# EAGLE design OCTOBOARDV_1.2 (EAGLE 9.6.0)
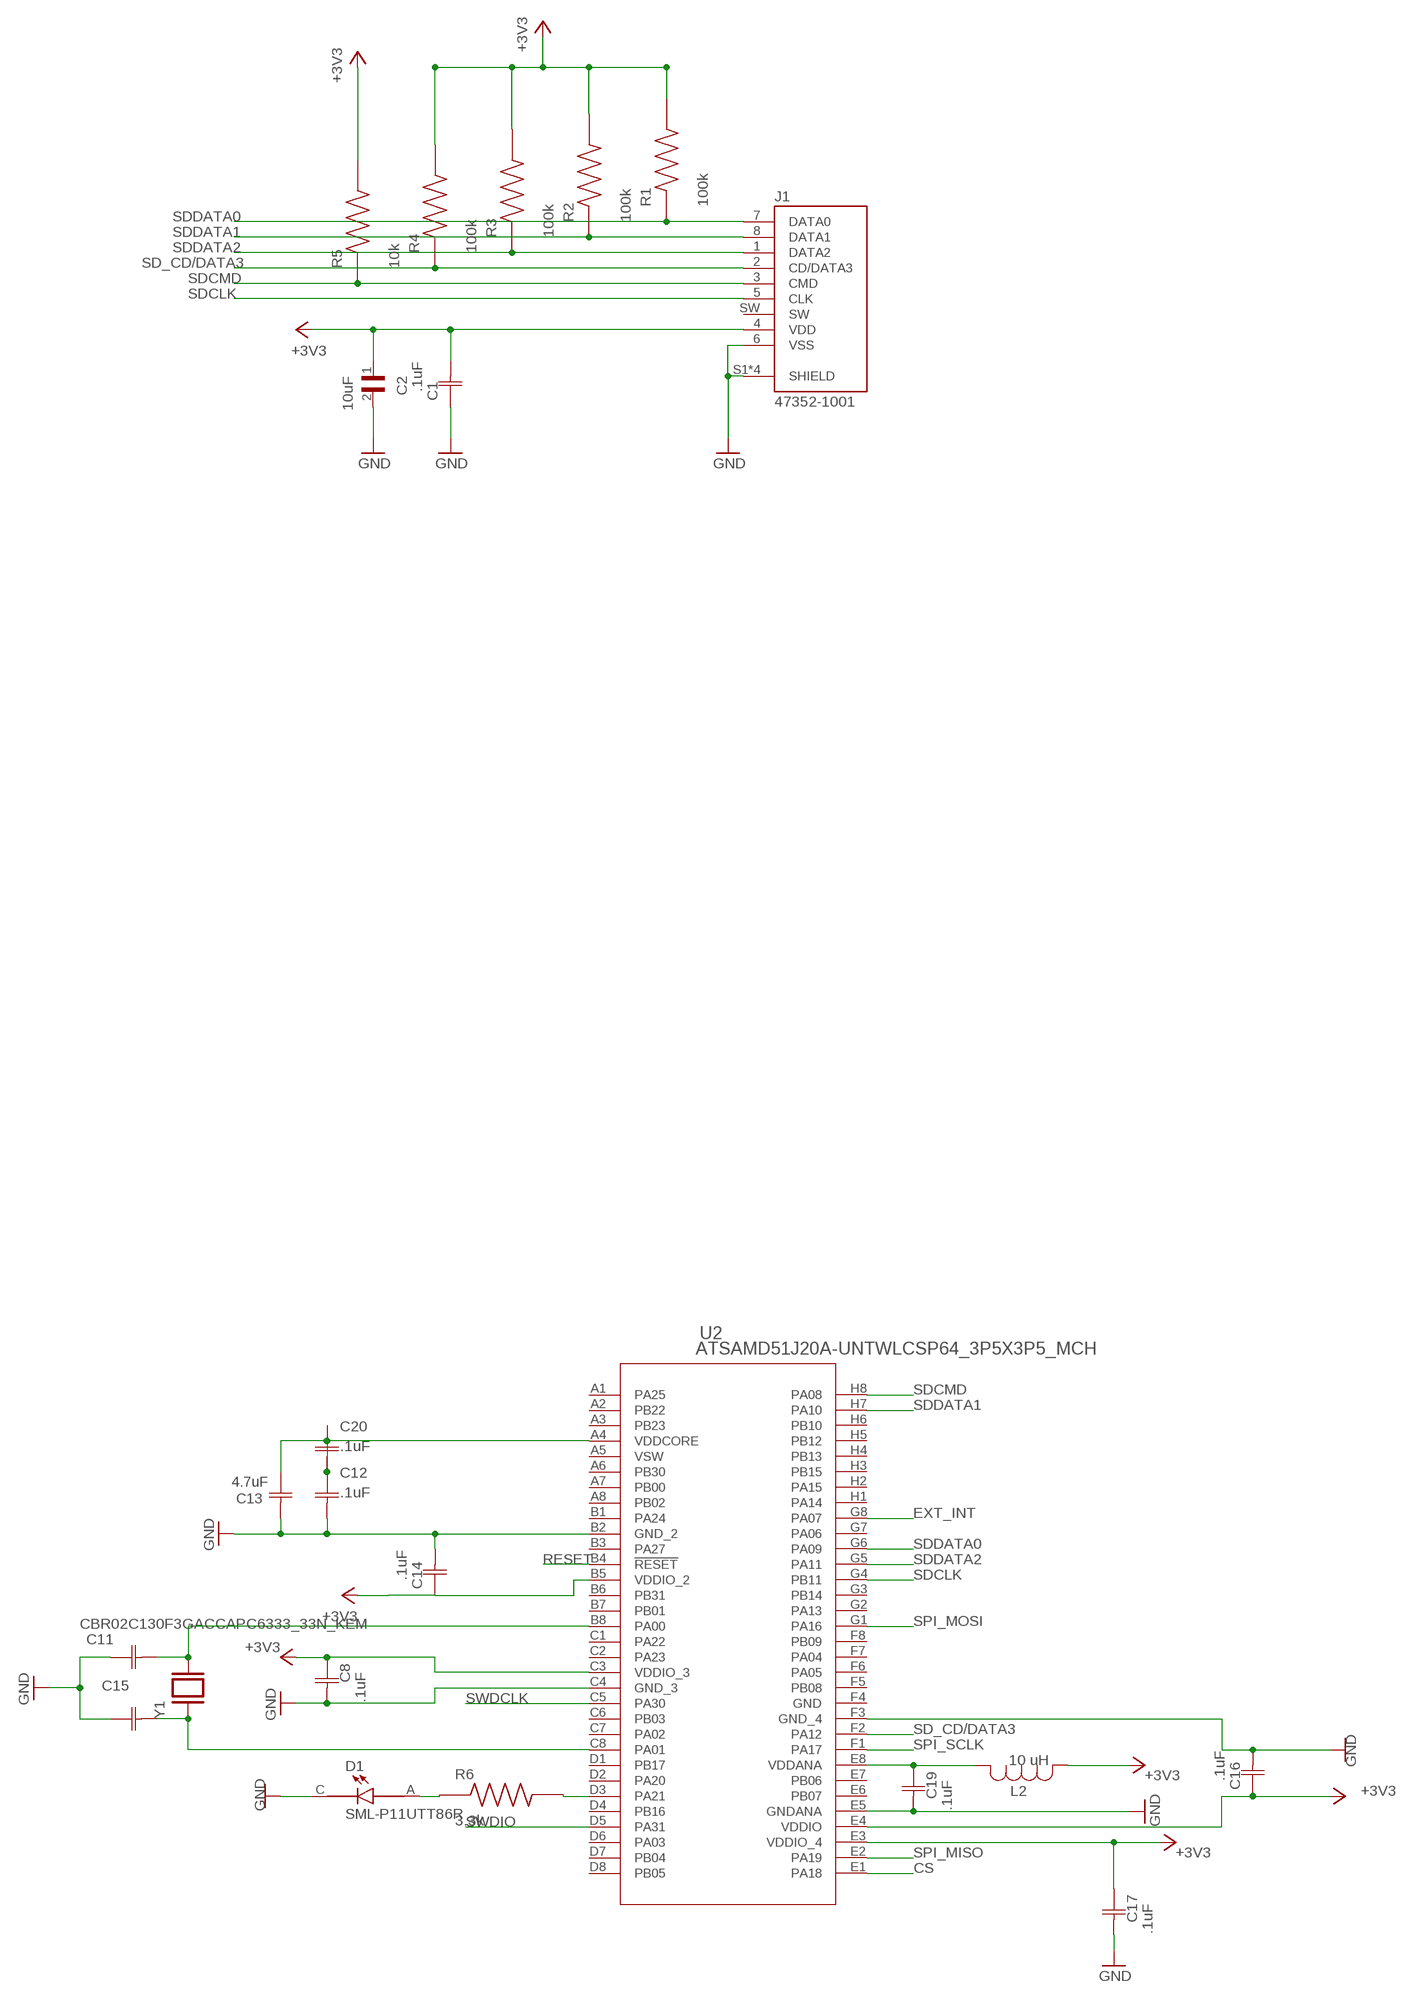
[diagram p0: schematic, sheet 1, part 1 of 2]
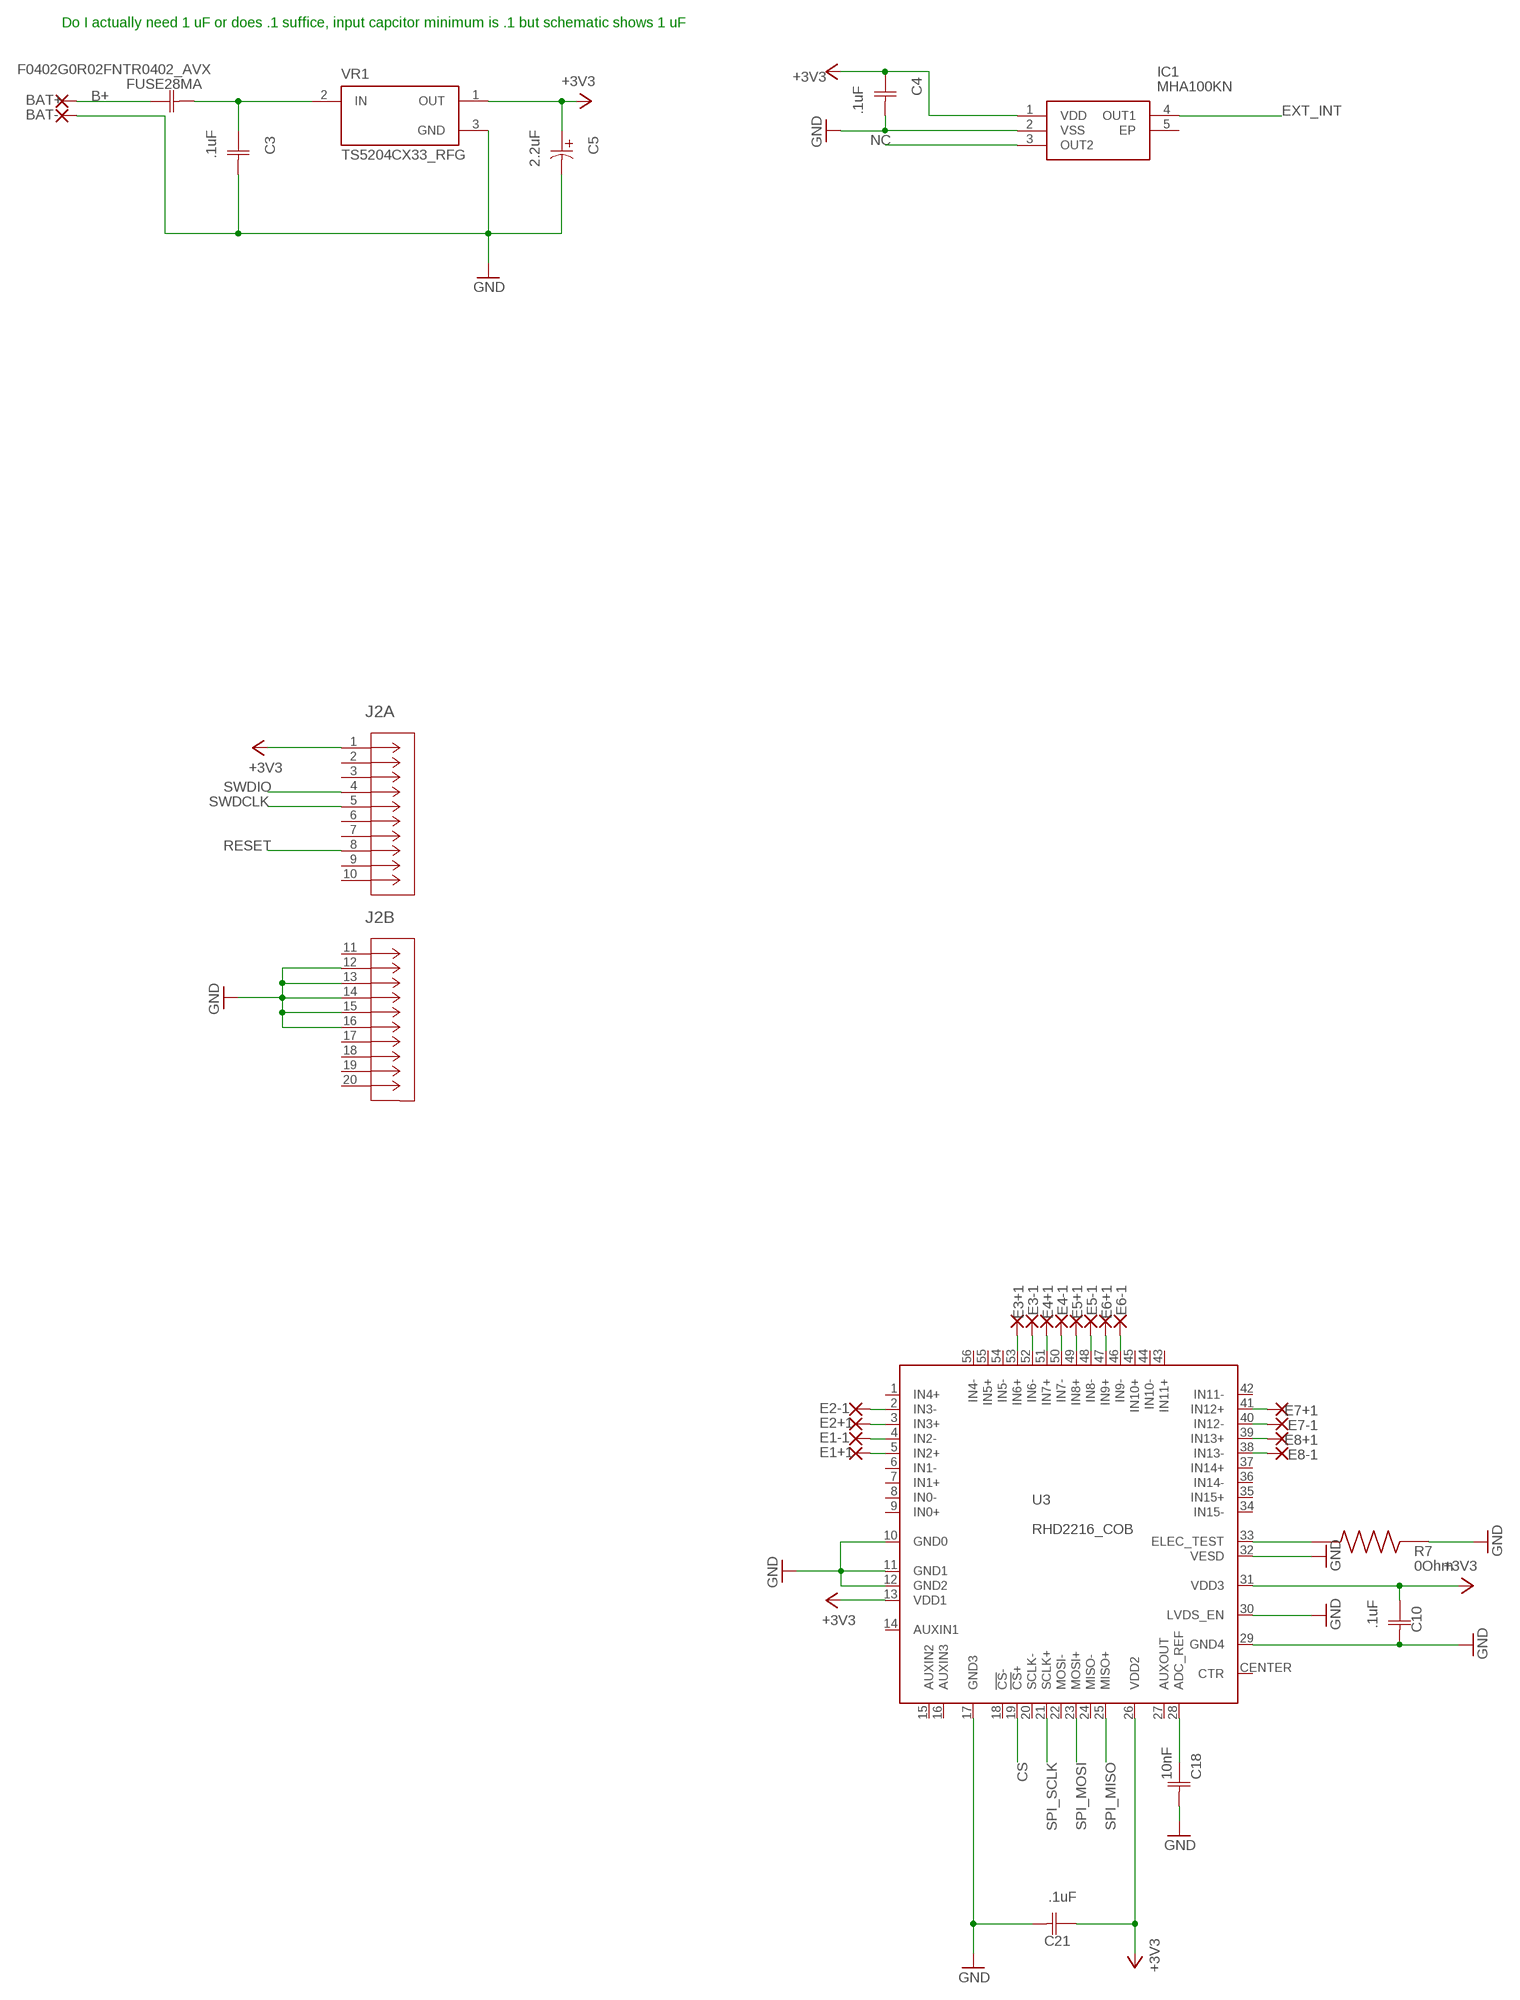
[diagram p1: schematic, sheet 1, part 2 of 2]

## Parts
BAT+  1.36/.71LEAD  [1,6/0,9]
BAT-  1.36/.71LEAD  [1,6/0,9]
C1  .1uF  0402B104K250CTCAP_0402_WAL  [CAP_0402_WAL]
C2  10uF  GRM155R61A106ME11D  [CAPC1005X70N]
C3  .1uF  0402B104K250CTCAP_0402_WAL  [CAP_0402_WAL]
C4  .1uF  0402B104K250CTCAP_0402_WAL  [CAP_0402_WAL]
C5  2.2uF  T491A225K016ATAUTOCAPMP3.4X1.6_1.8N_KEM  [CAPMP3.4X1.6_1.8N_KEM]
C8  .1uF  0402B104K250CTCAP_0402_WAL  [CAP_0402_WAL]
C10  .1uF  0402B104K250CTCAP_0402_WAL  [CAP_0402_WAL]
C11  CBR02C130F3GACCAPC6333_33N_KEM  [CAPC6333_33N_KEM]
C12  .1uF  0402B104K250CTCAP_0402_WAL  [CAP_0402_WAL]
C13  4.7uF  CM03X5R475M06AH055CAP_CM03_F_KAV  [CAP_CM03_F_KAV]
C14  .1uF  0402B104K250CTCAP_0402_WAL  [CAP_0402_WAL]
C15  CBR02C130F3GACCAPC6333_33N_KEM  [CAPC6333_33N_KEM]
C16  .1uF  0402B104K250CTCAP_0402_WAL  [CAP_0402_WAL]
C17  .1uF  0402B104K250CTCAP_0402_WAL  [CAP_0402_WAL]
C18  10nF  CM02X5R103M16AHCAP_00J25AH_AVX  [CAP_00J25AH_AVX]
C19  .1uF  0402B104K250CTCAP_0402_WAL  [CAP_0402_WAL]
C20  .1uF  0402B104K250CTCAP_0402_WAL  [CAP_0402_WAL]
C21  .1uF  0402B104K250CTCAP_0402_WAL  [CAP_0402_WAL]
D1  SML-P11UTT86R  [LED_SML-P11UTT86R]
E1+1  1.36/.71LEAD  [1,6/0,9]
E1-1  1.36/.71LEAD  [1,6/0,9]
E2+1  1.36/.71LEAD  [1,6/0,9]
E2-1  1.36/.71LEAD  [1,6/0,9]
E3+1  1.36/.71LEAD  [1,6/0,9]
E3-1  1.36/.71LEAD  [1,6/0,9]
E4+1  1.36/.71LEAD  [1,6/0,9]
E4-1  1.36/.71LEAD  [1,6/0,9]
E5+1  1.36/.71LEAD  [1,6/0,9]
E5-1  1.36/.71LEAD  [1,6/0,9]
E6+1  1.36/.71LEAD  [1,6/0,9]
E6-1  1.36/.71LEAD  [1,6/0,9]
E7+1  1.36/.71LEAD  [1,6/0,9]
E7-1  1.36/.71LEAD  [1,6/0,9]
E8+1  1.36/.71LEAD  [1,6/0,9]
E8-1  1.36/.71LEAD  [1,6/0,9]
FUSE28MA  F0402G0R02FNTR0402_AVX  F0402G0R20FNTR0402_AVX  [0402_AVX]
IC1  MHA100KN  [MHA100KN]
J1  47352-1001  [MOLEX_47352-1001]
J2  PRPC040DAAN-RCCONN80_PRP-040_4000X197_SUL  [CONN80_PRP-040_4000X197_SUL]
L2  10 uH  SDEB12101T-100MSDIND_SDEB12101T_CYN  [IND_SDEB12101T_CYN]
R1  100k  ERJ1GNJ104C  [RES_ERJ1GNJ104C]
R2  100k  ERJ1GNJ104C  [RES_ERJ1GNJ104C]
R3  100k  ERJ1GNJ104C  [RES_ERJ1GNJ104C]
R4  100k  ERJ1GNJ104C  [RES_ERJ1GNJ104C]
R5  10k  ERJ-1RHD1002C  [RES_ERJ-1RHD1002C]
R6  3.3k  ERJ-1GNF3301C  [RESC0603X26N]
R7  0Ohm  RMCF0201ZT0R00  [RESC0603X26N]
U2  ATSAMD51J20A-UNTWLCSP64_3P5X3P5_MCH  [WLCSP64_3P5X3P5_MCH]
U3  RHD2216_COB  [RHD2000_56PIN_COB]
VR1  TS5204CX33_RFG  [SOT95P280X110-3N]
Y1  CM9V-T1A-32.768KHZ-9PF-20PPM-TA-QC  [XTAL_CM9V-T1A-32.768KHZ-9PF-20PPM-TA-QC]

## Nets
+3V3: C1.2 C2.1 C4.1 C5.1 C8.1 C10.1 C17.1 C21.1 IC1.1(VDD) J1.4(VDD) J2.1 L2.2 R1.2 R2.2 R3.2 R4.2 R5.2 U2.C3(VDDIO_3) U2.E3(VDDIO_4) U3.13(VDD1) U3.26(VDD2) U3.31(VDD3) VR1.1(OUT)
B+: BAT+.1(P) FUSE28MA.1
CS: U2.E1(PA18) U3.19(!CS!+)
EXT_INT: IC1.4(OUT1) U2.G8(PA07)
GND: BAT-.1(P) C1.1 C2.2 C3.2 C4.2 C5.2 C8.2 C10.2 C11.1 C12.2 C13.2 C14.2 C15.1 C17.2 C18.2 C19.2 C21.2 D1.C IC1.2(VSS) J1.6(VSS) J1.S1(SHIELD) J1.S2(SHIELD) J1.S3(SHIELD) J1.S4(SHIELD) J2.12 J2.13 J2.14 J2.15 J2.16 R7.2 U2.B2(GND_2) U2.C4(GND_3) U2.E5(GNDANA) U3.10(GND0) U3.11(GND1) U3.12(GND2) U3.17(GND3) U3.29(GND4) U3.30(LVDS_EN) U3.32(VESD) VR1.3(GND)
N$1: C3.1 FUSE28MA.2 VR1.2(IN)
N$6: C18.1 U3.28(ADC_REF)
N$18: D1.A R6.1
N$21 [Test]: C11.2 U2.B8(PA00) Y1.2
N$24: R6.2 U2.D3(PA21)
N$25 [Test]: C15.2 U2.C8(PA01) Y1.1
N$31: R7.1 U3.33(ELEC_TEST)
N$33: E1+1.1(P) U3.5(IN2+)
N$34: E1-1.1(P) U3.4(IN2-)
N$35: E2+1.1(P) U3.3(IN3+)
N$36: E2-1.1(P) U3.2(IN3-)
N$37: E3+1.1(P) U3.53(IN6+)
N$38: E3-1.1(P) U3.52(IN6-)
N$39: E4+1.1(P) U3.51(IN7+)
N$40: E4-1.1(P) U3.50(IN7-)
N$41: E5+1.1(P) U3.49(IN8+)
N$42: C19.1 L2.1 U2.E8(VDDANA)
N$43: C16.2 U2.F3(GND_4) ; supply symbol labelled GND
N$44: C16.1 U2.E4(VDDIO) ; supply symbol labelled +3V3
N$45: C12.1 C13.1 C20.2 U2.A4(VDDCORE)
N$46: E5-1.1(P) U3.48(IN8-)
N$47: E6+1.1(P) U3.47(IN9+)
N$48: C14.1 U2.B5(VDDIO_2) ; supply symbol labelled +3V3
N$49: E6-1.1(P) U3.46(IN9-)
N$50: E7+1.1(P) U3.41(IN12+)
N$51: E7-1.1(P) U3.40(IN12-)
N$52: E8+1.1(P) U3.39(IN13+)
N$53: E8-1.1(P) U3.38(IN13-)
NC: IC1.3(OUT2)
RESET: J2.8 U2.B4(!RESET)
SD_CD/DATA3: J1.2(CD/DATA3) R4.1 U2.F2(PA12)
SDCLK: J1.5(CLK) U2.G4(PB11)
SDCMD: J1.3(CMD) R5.1 U2.H8(PA08)
SDDATA0: J1.7(DATA0) R1.1 U2.G6(PA09)
SDDATA1: J1.8(DATA1) R2.1 U2.H7(PA10)
SDDATA2: J1.1(DATA2) R3.1 U2.G5(PA11)
SPI_MISO: U2.E2(PA19) U3.25(MISO+)
SPI_MOSI: U2.G1(PA16) U3.23(MOSI+)
SPI_SCLK: U2.F1(PA17) U3.21(SCLK+)
SWDCLK: J2.5 U2.C5(PA30)
SWDIO: J2.4 U2.D5(PA31)
Unconnected: C20.1 IC1.5(EP) J1.SW J2.2 J2.3 J2.6 J2.7 J2.9 J2.10 J2.11 J2.17 J2.18 J2.19 J2.20 U2.A1(PA25) U2.A2(PB22) U2.A3(PB23) U2.A5(VSW) U2.A6(PB30) U2.A7(PB00) U2.A8(PB02) U2.B1(PA24) U2.B3(PA27) U2.B6(PB31) U2.B7(PB01) U2.C1(PA22) U2.C2(PA23) U2.C6(PB03) U2.C7(PA02) U2.D1(PB17) U2.D2(PA20) U2.D4(PB16) U2.D6(PA03) U2.D7(PB04) U2.D8(PB05) U2.E6(PB07) U2.E7(PB06) U2.F4(GND) U2.F5(PB08) U2.F6(PA05) U2.F7(PA04) U2.F8(PB09) U2.G2(PA13) U2.G3(PB14) U2.G7(PA06) U2.H1(PA14) U2.H2(PA15) U2.H3(PB15) U2.H4(PB13) U2.H5(PB12) U2.H6(PB10) U3.1(IN4+) U3.6(IN1-) U3.7(IN1+) U3.8(IN0-) U3.9(IN0+) U3.14(AUXIN1) U3.15(AUXIN2) U3.16(AUXIN3) U3.18(!CS!-) U3.20(SCLK-) U3.22(MOSI-) U3.24(MISO-) U3.27(AUXOUT) U3.34(IN15-) U3.35(IN15+) U3.36(IN14-) U3.37(IN14+) U3.42(IN11-) U3.43(IN11+) U3.44(IN10-) U3.45(IN10+) U3.54(IN5-) U3.55(IN5+) U3.56(IN4-)

## Notes on the sheet
- Do I actually need 1 uF or does .1 suffice, input capcitor minimum is .1 but schematic shows 1 uF

## Power pins joined to a net without a drawn wire
CTR: U3.CENTER(CTR)

## Library data of the parts
BAT+ BAT- E1+1 E1-1 E2+1 E2-1 E3+1 E3-1 E4+1 E4-1 E5+1 E5-1 E6+1 E6-1 E7+1 E7-1 E8+1 E8-1 = wirepadedit:1.36/.71LEAD: THROUGH-HOLE PAD
C1 C3 C4 C8 C10 C12 C14 C16 C17 C19-C21 = 01uFCap:0402B104K250CT; COPYRIGHT: Copyright (C) 2023 Ultra Librarian. All rights reserved.; MANUFACTURER_PART_NUMBER: 0402B104K250CT; MFR_NAME: Walsin
C2 = 10uFCap:GRM155R61A106ME11D: CAP CER 10UF 10V X5R 0402 Check availability <https://pricing.snapeda.com/parts/GRM155R61A106ME11D/Murata%20Electronics/view-part?ref=eda>; AVAILABILITY: In Stock; DESCRIPTION: SMD capacitor X5R(EIA) with capacitance 10uF Tol.20%. Rated voltage 10Vdc 85C; MF: Murata Electronics; MP: GRM155R61A106ME11D; PACKAGE: 1005 Murata; PRICE: None; PURCHASE-URL: https://pricing.snapeda.com/search/part/GRM155R61A106ME11D/?ref=eda
C5 = 2_2uFCap:T491A225K016ATAUTO; COPYRIGHT: Copyright (C) 2023 Ultra Librarian. All rights reserved.; MANUFACTURER_PART_NUMBER: T491A225K016ATAUTO; MFR_NAME: Kemet
C11 C15 = 13pFCap:CBR02C130F3GAC; COPYRIGHT: Copyright (C) 2023 Ultra Librarian. All rights reserved.; MANUFACTURER_PART_NUMBER: CBR02C130F3GAC; MFR_NAME: Kemet
C13 = 4_7uFCap0603:CM03X5R475M06AH055; COPYRIGHT: Copyright (C) 2023 Ultra Librarian. All rights reserved.; MANUFACTURER_PART_NUMBER: CM03X5R475M06AH055; MFR_NAME: KYOCERA AVX
C18 = 10nFCap:CM02X5R103M16AH; COPYRIGHT: Copyright (C) 2023 Ultra Librarian. All rights reserved.; MANUFACTURER_PART_NUMBER: CM02X5R103M16AH; MFR_NAME: KYOCERA AVX
D1 = SML_P11UTT86R:SML-P11UTT86R: LED, PICOLED, Red, 621 nm, 1.8 V, 1 mA, 2.5 mcd; MANUFACTURER: ROHM Semiconductor; PARTREV: 007; STANDARD: Manufacturer Recommendation
FUSE28MA = fuse28mA:F0402G0R20FNTR; COPYRIGHT: Copyright (C) 2023 Ultra Librarian. All rights reserved.; MANUFACTURER_PART_NUMBER: F0402G0R20FNTR; MFR_NAME: KYOCERA AVX
IC1 = MHA100KN:MHA100KN: Board Mount Hall Effect / Magnetic Sensors High Performance Low Power Hall-Effect Sensor Source: Datasheet <https://www.memsic.com/Public/Uploads/uploadfile/files/20220119/MHA100KNDatasheetRevA.pdf>; DESCRIPTION: Board Mount Hall Effect / Magnetic Sensors High Performance Low Power Hall-Effect Sensor; HEIGHT: 0.42mm; MANUFACTURER_NAME: MEMSIC; MANUFACTURER_PART_NUMBER: MHA100KN; MOUSER_PART_NUMBER: 438-MHA100KN; MOUSER_PRICE-STOCK: https://www.mouser.co.uk/ProductDetail/MEMSIC/MHA100KN?qs=W%2FMpXkg%252BdQ6cWUMxnX3l5w%3D%3D
J1 = 47352-1001:47352-1001: 1.10mm Pitch microSD Card Connector, Push-Push Type, with VSS (Supply Voltage Ground) Detect Switch, Lead-Free; DESCRIPTION: 8 (6 + 2) Position Card Connector Secure Digital - microSD™ Surface Mount, Right Angle Gold; DIGI-KEY_PART_NUMBER: WM3290CT-ND; MF: Molex; MP: 47352-1001; PACKAGE: None; PURCHASE-URL: https://pricing.snapeda.com/search/part/47352-1001/?ref=eda
J2 = Header:PRPC040DAAN-RC; COPYRIGHT: Copyright (C) 2023 Ultra Librarian. All rights reserved.; MANUFACTURER_PART_NUMBER: PRPC040DAAN-RC; MFR_NAME: Sullins; TYPE: Headers, Male Pins
L2 = 10uH_inductor:SDEB12101T-100MSD; COPYRIGHT: Copyright (C) 2023 Ultra Librarian. All rights reserved.; MANUFACTURER_PART_NUMBER: SDEB12101T-100MSD; MFR_NAME: Cyntec
R1-R4 = 100kRes:ERJ1GNJ104C: Check availability <https://pricing.snapeda.com/parts/ERJ-1GNJ104C/Panasonic/view-part?ref=eda>; AVAILABILITY: In Stock; DESCRIPTION: 100 kOhms 5% 0.05W, 1/20W Chip Resistor 0201 (0603 Metric) Automotive AEC-Q200 Thick Film; MF: Panasonic; MP: ERJ-1GNJ104C; PACKAGE: 0603-2 Panasonic; PRICE: None; PURCHASE-URL: https://pricing.snapeda.com/search/part/ERJ-1GNJ104C/?ref=eda
R5 = 10kRes:ERJ-1RHD1002C: Check availability <https://pricing.snapeda.com/parts/ERJ-1RHD1002C/Panasonic%20Electronic/view-part?ref=eda>; AVAILABILITY: In Stock; DESCRIPTION: 10 kOhms ±0.5% 0.05W, 1/20W Chip Resistor 0201 (0603 Metric) - Thick Film; MF: Panasonic Electronic; MP: ERJ-1RHD1002C; PACKAGE: 201-2 Panasonic; PRICE: None; PURCHASE-URL: https://pricing.snapeda.com/search/part/ERJ-1RHD1002C/?ref=eda
R6 = 3_3kRes:ERJ-1GNF3301C: Res Thick Film 0201 3.3K Ohm 1% 0.05W(1/20W) ±200ppm/C SMD Automotive T/R
R7 = RMCF0201ZT0R00:RMCF0201ZT0R00: Check availability <https://pricing.snapeda.com/parts/RMCF0201ZT0R00/Stackpole%20Electronics%20Inc/view-part?ref=eda>; AVAILABILITY: In Stock; DESCRIPTION: 0 Ohms Jumper 0.05W, 1/20W Chip Resistor 0201 (0603 Metric) - Thick Film; MF: Stackpole Electronics Inc; MP: RMCF0201ZT0R00; PACKAGE: 0603 Rohm Semiconductor; PRICE: None; PURCHASE-URL: https://pricing.snapeda.com/search/part/RMCF0201ZT0R00/?ref=eda
U2 = 2023-06-28_02-51-08_Library:ATSAMD51J20A-UNT; COPYRIGHT: Copyright (C) 2023 Ultra Librarian. All rights reserved.; MANUFACTURER_PART_NUMBER: ATSAMD51J20A-UNT; MFR_NAME: Microchip
U3 = RHD2000:RHD2216: Intan Technologies RHD2216 chip
VR1 = TS5204CX33_RFG_VLTREG:TS5204CX33_RFG: Check availability <https://pricing.snapeda.com/parts/TS5204CX33%20RFG/Taiwan%20Semiconductor%20Corporation/view-part?ref=eda>; AVAILABILITY: In Stock; DESCRIPTION: 80MA 3.3V ULTRA LOW DROPOUT VOLTAGE REGULATOR; MF: Taiwan Semiconductor Corporation; MP: TS5204CX33 RFG; PACKAGE: SOT-23-3 Taiwan Semiconductor; PRICE: None; PURCHASE-URL: https://pricing.snapeda.com/search/part/TS5204CX33 RFG/?ref=eda
Y1 = CM9V-T1A-32.768KHZ-9PF-20PPM-TA-QC:CM9V-T1A-32.768KHZ-9PF-20PPM-TA-QC: Check availability <https://pricing.snapeda.com/parts/CM9V-T1A-32.768KHZ-9PF-20PPM-TA-QC/Micro%20Crystal%20AG/view-part?ref=eda>; AVAILABILITY: In Stock; DESCRIPTION: LOW FREQUENCY CRYSTAL; MF: Micro Crystal AG; MP: CM9V-T1A-32.768KHZ-9PF-20PPM-TA-QC; PACKAGE: SMD-2 Micro Crystal; PRICE: None; PURCHASE-URL: https://pricing.snapeda.com/search/part/CM9V-T1A-32.768KHZ-9PF-20PPM-TA-QC/?ref=eda

## Board
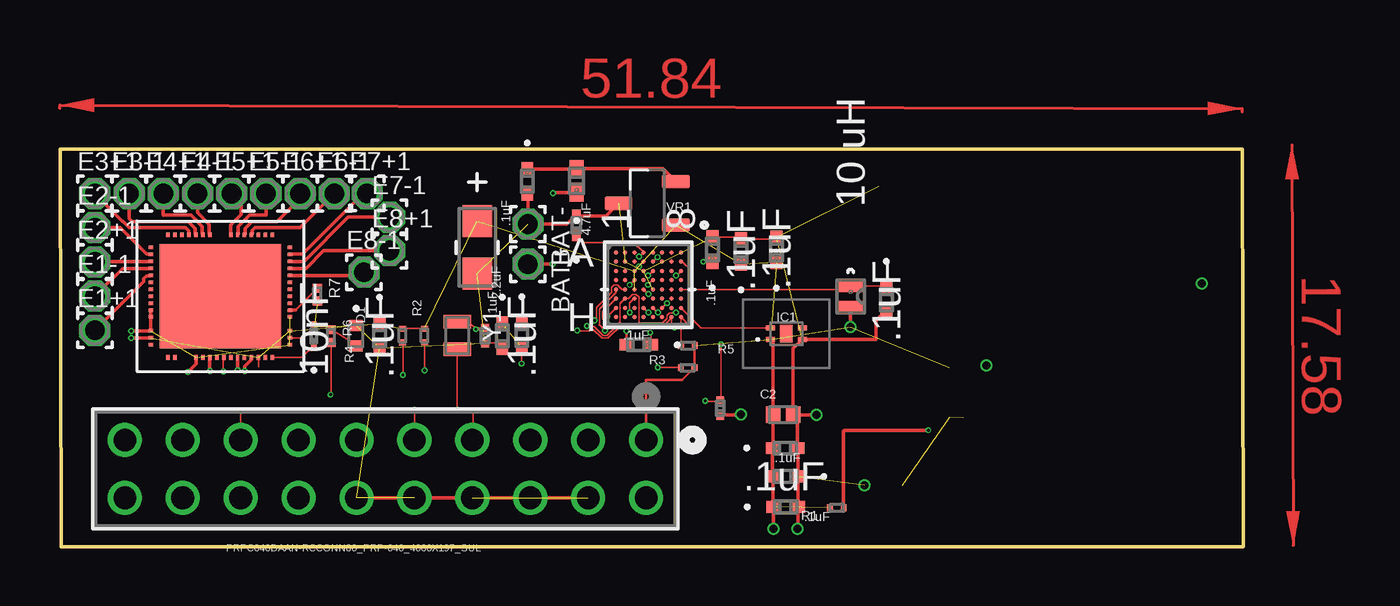
[diagram p2: board, top side]
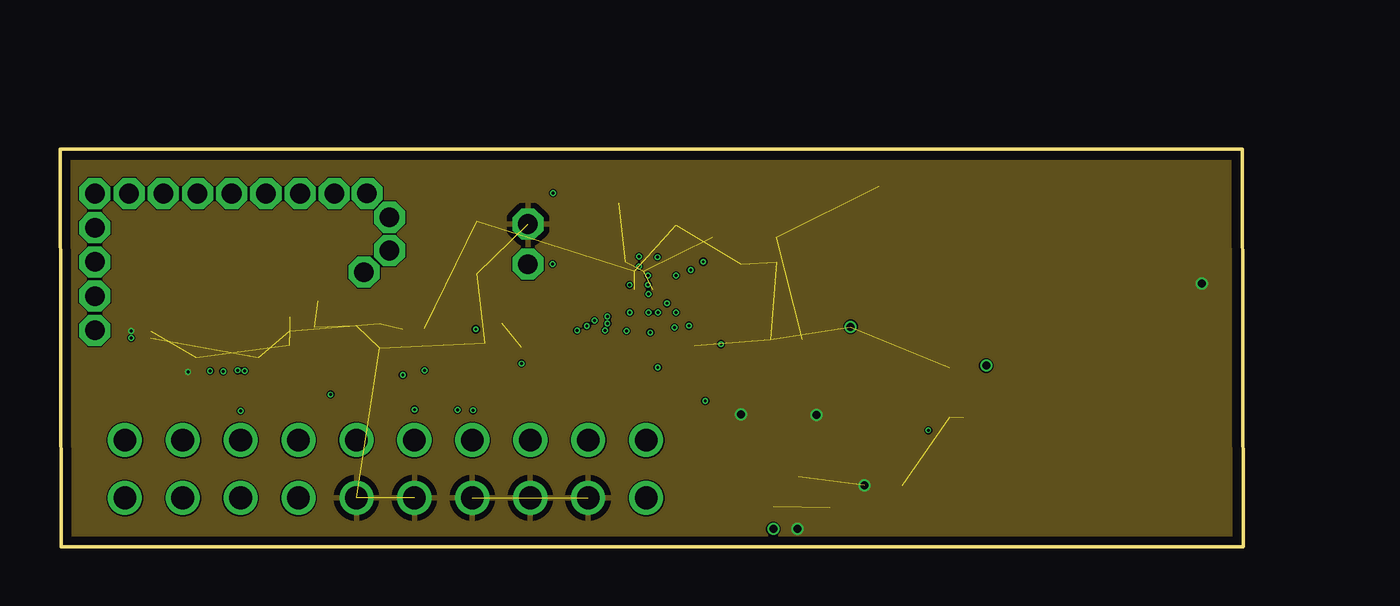
[diagram p3: board, inner layer Route2]
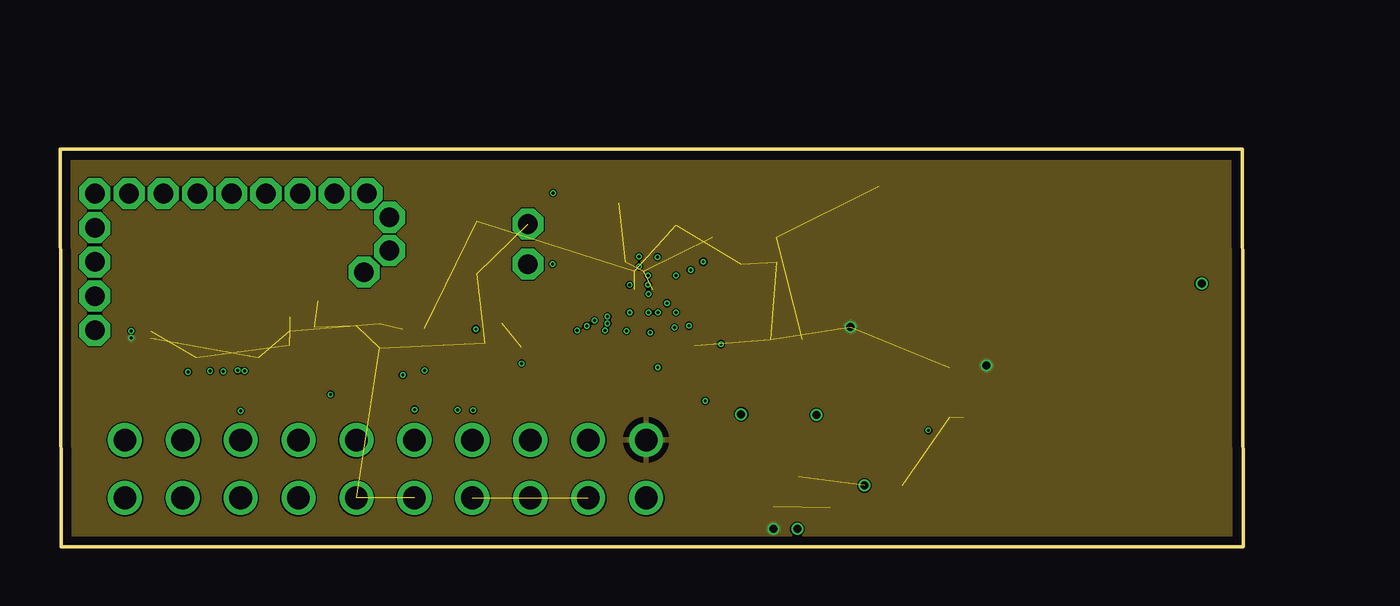
[diagram p4: board, inner layer Route15]
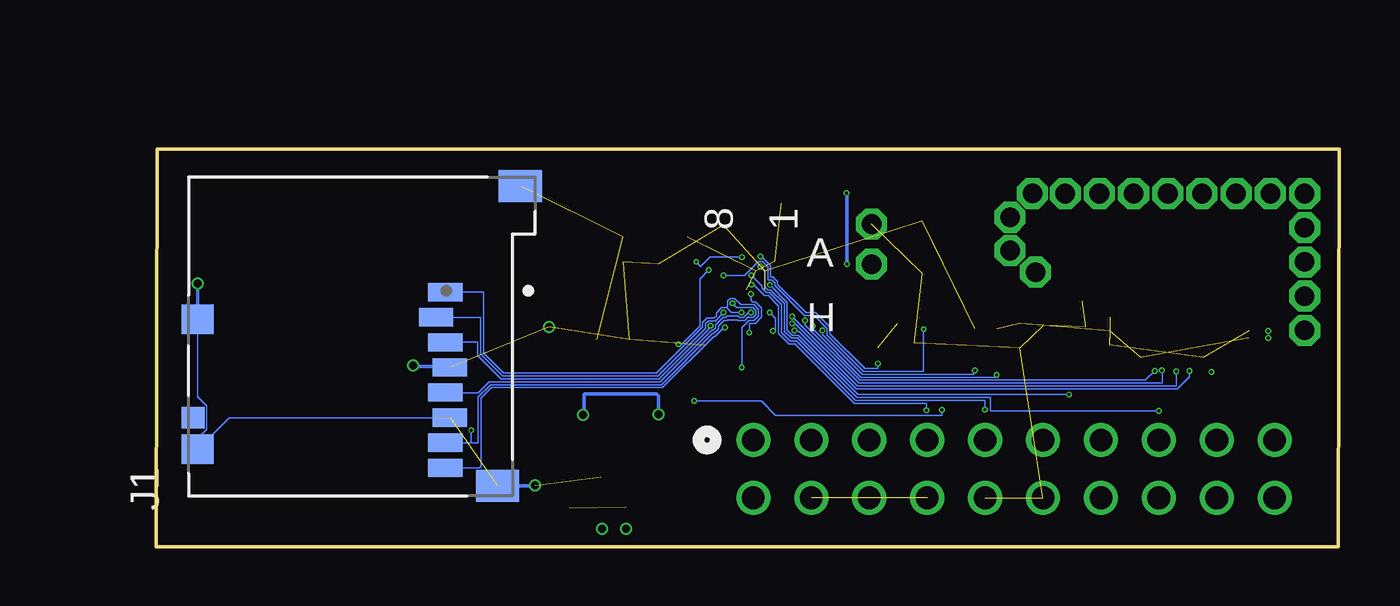
[diagram p5: board, bottom side, seen from below]

Size 51.89 x 17.45 mm. Coordinates in mm from the lower left corner, seen from the top.
Outline: 0.05,0 0,17.45 51.84,17.45 51.89,0 0.05,0
Copper layers (1*2*15*16): Top 0.035559375mm / dielectric 0.17018125mm / Route2 0.01778125mm / dielectric 47mil / Route15 0.01778125mm / dielectric 0.17018125mm / Bottom 0.035559375mm
Design rules "oshpark-4layer *": minimum track width 2mil, minimum drill 2.5mil, track to track 2mil, track to pad 2mil, pad to pad 2mil, via to via 2mil, smd to smd 2mil, copper to edge 15mil, drill to drill 6mil, minimum pad ring 2.5mil, minimum via ring 2.5mil, stop-mask expansion 1.5mil, vias tented up to drill 0mil, thermal gap 10mil

### Footprints (pad centres in the part's own frame; a part is rotated, then mirrored left to right if it is on the bottom)
1,6/0,9 = drill 0.86 pad 1.36 octagon: 1 0,0
CAP_0402_WAL = smd 0.604 x 0.508: 1 -0.543,0; 2 0.543,0
CAPC1005X70N = smd 0.64 x 0.72: 1 -0.439,0; 2 0.439,0
CAPMP3.4X1.6_1.8N_KEM = smd 1.399 x 1.3: 1 -1.151,0; 2 1.151,0
CAPC6333_33N_KEM = smd 0.43 x 0.33: 1 -0.3,0; 2 0.3,0
CAP_CM03_F_KAV = smd 0.579 x 0.381: 1 -0.404,0; 2 0.404,0
CAP_00J25AH_AVX = smd 0.502 x 0.229: 1 -0.404,0; 2 0.404,0
LED_SML-P11UTT86R = smd 0.5 x 0.6: A 0.45,0; C -0.45,0
0402_AVX = smd 0.756 x 0.61: 1 -0.531,0; 2 0.531,0
MHA100KN = smd 0.4 x 0.22: 1 -0.7,-0.25; 2 0.7,-0.25; 3 0.7,0.25; 4 -0.7,0.25 | smd 0.55 x 0.75: 5 0,0
MOLEX_47352-1001 = smd 0.8 x 1.5: 1 1.94,-3.66; 2 0.84,-3.26; 3 -0.26,-3.66; 4 -1.36,-3.86; 5 -2.46,-3.66; 6 -3.56,-3.86; 7 -4.66,-3.66; 8 -5.76,-3.66 | smd 1.3 x 1.4: S1 -4.95,7.2; S2 0.75,7.2 | smd 1.4 x 1.9: S3 -6.55,-5.95; S4 6.6,-6.95 | smd 0.95 x 1: SW -3.56,7.4
CONN80_PRP-040_4000X197_SUL = drill 0.991 pad 1.499: 1 0,0; 2 -2.54,0; 3 -5.08,0; 4 -7.62,0; 5 -10.16,0; 6 -12.7,0; 7 -15.24,0; 8 -17.78,0; 9 -20.32,0; 10 -22.86,0; 11 0,-2.54; 12 -2.54,-2.54; 13 -5.08,-2.54; 14 -7.62,-2.54; 15 -10.16,-2.54; 16 -12.7,-2.54; 17 -15.24,-2.54; 18 -17.78,-2.54; 19 -20.32,-2.54; 20 -22.86,-2.54
IND_SDEB12101T_CYN = smd 0.508 x 1.194: 1 -0.45,0; 2 0.45,0
RES_ERJ1GNJ104C = smd 0.25 x 0.3: 1 -0.3,0; 2 0.3,0
RES_ERJ-1RHD1002C = smd 0.25 x 0.3: 1 -0.3,0; 2 0.3,0
RESC0603X26N = smd 0.38 x 0.4: 1 -0.281,0; 2 0.281,0
WLCSP64_3P5X3P5_MCH = smd 0.203 x 0.203: A1 -1.422,1.422; A2 -1.016,1.422; A3 -0.61,1.422; A4 -0.203,1.422; A5 0.203,1.422; A6 0.61,1.422; A7 1.016,1.422; A8 1.422,1.422; B1 -1.422,1.016; B2 -1.016,1.016; B3 -0.61,1.016; B4 -0.203,1.016; B5 0.203,1.016; B6 0.61,1.016; B7 1.016,1.016; B8 1.422,1.016; C1 -1.422,0.61; C2 -1.016,0.61; C3 -0.61,0.61; C4 -0.203,0.61; C5 0.203,0.61; C6 0.61,0.61; C7 1.016,0.61; C8 1.422,0.61; D1 -1.422,0.203; D2 -1.016,0.203; D3 -0.61,0.203; D4 -0.203,0.203; D5 0.203,0.203; D6 0.61,0.203; D7 1.016,0.203; D8 1.422,0.203; E1 -1.422,-0.203; E2 -1.016,-0.203; E3 -0.61,-0.203; E4 -0.203,-0.203; E5 0.203,-0.203; E6 0.61,-0.203; E7 1.016,-0.203; E8 1.422,-0.203; F1 -1.422,-0.61; F2 -1.016,-0.61; F3 -0.61,-0.61; F4 -0.203,-0.61; F5 0.203,-0.61; F6 0.61,-0.61; F7 1.016,-0.61; F8 1.422,-0.61; G1 -1.422,-1.016; G2 -1.016,-1.016; G3 -0.61,-1.016; G4 -0.203,-1.016; G5 0.203,-1.016; G6 0.61,-1.016; G7 1.016,-1.016; G8 1.422,-1.016; H1 -1.422,-1.422; H2 -1.016,-1.422; H3 -0.61,-1.422; H4 -0.203,-1.422; H5 0.203,-1.422; H6 0.61,-1.422; H7 1.016,-1.422; H8 1.422,-1.422
RHD2000_56PIN_COB = smd 0.203 x 0.152: 1 -3.048,2.134; 2 -3.048,1.829; 3 -3.048,1.524; 4 -3.048,1.219; 5 -3.048,0.914; 6 -3.048,0.61; 7 -3.048,0.305; 8 -3.048,0; 9 -3.048,-0.305; 10 -3.048,-0.61; 11 -3.048,-0.914; 12 -3.048,-1.524; 13 -3.048,-1.829; 14 -3.048,-2.134; 29 3.048,-2.134; 30 3.048,-1.829; 31 3.048,-1.524; 32 3.048,-0.914; 33 3.048,-0.61; 34 3.048,-0.305; 35 3.048,0; 36 3.048,0.305; 37 3.048,0.61; 38 3.048,0.914; 39 3.048,1.219; 40 3.048,1.524; 41 3.048,1.829; 42 3.048,2.134 | smd 0.152 x 0.203: 15 -2.286,-2.692; 16 -1.981,-2.692; 17 -1.067,-2.692; 18 -0.762,-2.692; 19 -0.457,-2.692; 20 -0.152,-2.692; 21 0.152,-2.692; 22 0.457,-2.692; 23 0.762,-2.692; 24 1.067,-2.692; 25 1.372,-2.692; 26 1.676,-2.692; 27 1.981,-2.692; 28 2.286,-2.692; 43 2.286,2.692; 44 1.981,2.692; 45 1.676,2.692; 46 1.372,2.692; 47 1.067,2.692; 48 0.762,2.692; 49 0.457,2.692; 50 -0.457,2.692; 51 -0.762,2.692; 52 -1.067,2.692; 53 -1.372,2.692; 54 -1.676,2.692; 55 -1.981,2.692; 56 -2.286,2.692 | smd 5.334 x 4.572: CENTER 0,0
SOT95P280X110-3N = smd 1.21 x 0.59: 1 -1.255,0.95; 2 -1.255,-0.95; 3 1.255,0
XTAL_CM9V-T1A-32.768KHZ-9PF-20PPM-TA-QC = smd 0.6 x 1.2: 1 -0.6,0; 2 0.6,0

### Placement (x,y rotation side)
BAT+  20.52,12.41 270 top
BAT-  20.52,14.17 270 top
C1  31.81,3.1 180 top
C2  31.71,5.8 0 top
C3  20.49,16.04 270 top
C4  31.82,1.76 0 top
C5  18.29,13.14 270 top
C8  31.8,4.34 0 top
C10  29.86,12.97 90 top
C11  28.95,6.08 90 top
C12  19.39,9.27 270 top
C13  22.64,14.11 90 top
C14  28.61,13.05 90 top
C15  18.64,9.26 90 top
C16  25.38,8.87 180 top
C17  31.42,13.04 90 top
C18  11.14,9.25 90 top
C19  36.24,10.84 270 top
C20  20.25,9.29 270 top
C21  14.01,9.27 270 top
D1  12.98,9.27 270 top
E1+1  1.53,9.5 0 top
E1-1  1.53,11 0 top
E2+1  1.53,12.5 0 top
E2-1  1.53,14 0 top
E3+1  1.53,15.5 0 top
E3-1  3.03,15.5 0 top
E4+1  4.53,15.5 0 top
E4-1  6.03,15.5 0 top
E5+1  7.53,15.5 0 top
E5-1  9.03,15.5 0 top
E6+1  10.53,15.5 0 top
E6-1  12.03,15.5 0 top
E7+1  13.46,15.51 0 top
E7-1  14.44,14.46 0 top
E8+1  14.44,13 0 top
E8-1  13.33,12.06 0 top
FUSE28MA  22.66,16.07 90 top
IC1  31.85,9.35 0 top
J1  42.87,9.23 90 bottom
J2  25.7,4.69 0 top
L2  34.67,11 270 top
R1  34.06,1.71 180 top
R2  15.99,9.28 90 top
R3  27.52,7.87 0 top
R4  15.02,9.27 90 top
R5  27.53,8.85 0 top
R6  11.89,9.25 270 top
R7  11.29,11.07 270 top
U2  25.8,11.5 0 top
U3  7.03,11 0 top
VR1  25.75,15.08 180 top
Y1  17.42,9.28 270 top

### Tracks (layer width: path | path; a pad name or v marks a point on that pad's centre or on a via)
+3V3  (via drill 0.13, 0.35)  (15 unrouted)
  Top 0.076: U3.26 8.7,7.9 | R4.2 R2.2
  Top 0.102: R5.2 27.82,8.84 R3.2 27.27,7.32 25.7,7.32 J2.1
  Top 0.152: IC1.1 31.27,8.98 C2.1 31.27,4.36 C8.1 31.25,3.11 C1.2 C4.1 v31.28,0.79 | U3.13 3.15,9.18 3.15,9.17 v3.12,9.17 | v31.28,0.79 31.28,0.75 31.29,0.74 31.29,0.78 v31.28,0.79 | L2.2 v34.67,9.66
  Bottom 0.152: J1.4 39.07,7.93 40.61,7.93 v40.61,7.95
  pour Route15: 51.98,-26.97 -0.02,-26.97 -0.02,17.53 51.98,17.53
B+  (via drill 0.13)
  Top 0.152: BAT+.1 21.58,12.41 21.59,12.4 v21.6,12.41 | v21.61,15.52 21.63,15.54 FUSE28MA.1
  Bottom 0.152: v21.6,12.41 21.6,15.51 v21.61,15.52
CS  (via drill 0.13)
  Top 0.076: U2.E1 24.38,11.16 23.66,10.45 23.66,9.77 23.65,9.76 v23.9,9.5
  Top 0.152: U3.19 v6.57,7.73 v6.58,7.73
  Bottom 0.076: v23.9,9.5 23.85,9.45 23.7,9.45 21.19,6.94 7.11,6.94 6.58,7.47 v6.58,7.73
EXT_INT
  Top 0.076: U2.G8 28.11,9.6 IC1.4
GND  (via drill 0.13, 0.35)  (23 unrouted)
  Top 0.076: C12.2 19.16,8.96 C15.1 | U3.30 10.66,9.18 C18.2 | C14.2 29.78,13.59 C10.2 31.34,13.51 C17.2
  Top 0.152: 11.07,10.79 R7.2 11.3,10.8 | C19.2 36.15,10.3 35.79,9.94 35.79,9.1 32.56,9.1 IC1.2 32.15,8.7 C2.2 32.19,5.76 | U3.10 U3.11 U3.12 v3.13,9.48 v3.12,9.48 | U3.17 5.96,8.02 v5.61,7.67 | 32.19,5.76 32.34,5.61 C8.2 32.35,4.33 C1.1 | C11.1 29.73,5.78 29.77,5.82 v29.87,5.82 | v33.17,5.8 32.23,5.8 32.19,5.76 | C1.1 C4.2 32.37,0.77 32.36,0.77 v32.33,0.79 | J2.16 J2.12 | C3.2 20.52,15.46 BAT-.1 22.22,14.17 22.39,14.33 22.45,14.33 C13.2 23.94,14.52 VR1.3 | C1.1 32.38,3.08 | C1.1
  Bottom 0.076: J1.S2 50.07,6.58 49.68,6.19 49.68,5.16 50.07,4.77 J1.S1 48.69,5.67 39.62,5.67
  Bottom 0.152: v29.87,5.82 29.87,6.63 29.95,6.71 33.1,6.71 33.12,6.68 33.12,5.8 v33.17,5.8 | J1.S3 35.34,2.68 35.33,2.7 v35.28,2.7 | J1.S2 50.07,11.52 50.09,11.54 v50.06,11.56
  pour Route2: -0.02,17.53 -0.02,-26.97 51.98,-26.97 51.98,17.53
N$1
  Top 0.152: VR1.2 26.43,16.6 FUSE28MA.2 22.64,16.58 C3.1
N$6
  Top 0.076: U3.28 10.61,8.31 C18.1
N$18
  Top 0.076: D1.A 12.83,8.97 R6.1
N$21  (via drill 0.13)
  Top 0.076: Y1.2 17.42,7.55 17.42,6.02 v17.44,6.01 | v28.29,6.4 28.31,6.38 28.93,6.38 | 28.93,6.38 C11.2 | U2.B8 27.28,12.52 v27.66,12.15 | v28.98,8.89 28.98,6.44 28.93,6.38
  Bottom 0.076: v17.44,6.01 17.44,5.78 24.73,5.78 25.35,6.4 28.19,6.4 | 28.22,6.38 28.19,6.4 | v28.29,6.4 28.19,6.4 | v27.66,12.15 28.05,11.75 28.05,9.7 28.85,8.89 v28.98,8.89
N$24  (via drill 0.13)
  Top 0.076: U2.D3 24.92,11.44 | 24.92,11.44 | 24.92,11.44 v24.98,11.5 | R6.2 11.89,6.71 v11.86,6.68
  Bottom 0.076: v24.98,11.5 24.22,10.74 24.22,9.52 23.99,9.29 23.72,9.29 21.11,6.68 v11.86,6.68
N$25  (via drill 0.13)
  Top 0.076: U2.C8 27.22,12.09 26.96,11.83 26.96,11.86 v27.01,11.91 | Y1.1 17.92,9.88 v18.24,9.56
  Top 0.152: C15.2 v18.24,9.56 v18.24,9.55
  Bottom 0.076: v27.01,11.91 26.1,11.91 25.48,12.52 25.3,12.52 25.07,12.29 25.07,11.72 25.07,11.71 24.89,11.71 24.77,11.59 24.77,11.46 23.45,10.15 23.02,10.15 22.47,9.59 22.47,9.41 22.47,9.3 20.87,7.7 18.24,7.7 v18.24,9.55
N$31
  Top 0.076: 10.33,10.4 | 10.33,10.4 R7.1
  Top 0.152: U3.33 10.33,10.4
N$33
  Top 0.152: U3.5 3.96,11.89 3.8,11.89 3.68,11.78 3.68,11.65 E1+1.1
N$34
  Top 0.152: U3.4 2.75,12.22 E1-1.1
N$35
  Top 0.152: U3.3 1.55,12.53 E2+1.1
N$36
  Top 0.152: U3.2 3.96,12.86 3.8,12.86 2.65,14.01 E2-1.1
N$37
  Top 0.152: U3.53 5.63,13.72 5.63,13.88 5.51,14.01 3.05,14.01 2.77,14.28 2.75,14.28 E3+1.1
N$38
  Top 0.152: U3.52 5.94,13.72 5.94,13.97 5.63,14.28 3.16,14.28 3.03,14.42 E3-1.1
N$39
  Top 0.152: U3.51 6.24,13.72 6.24,14.06 5.74,14.56 4.53,14.56 E4+1.1
N$40
  Top 0.152: U3.50 6.55,13.72 6.55,14.15 6.03,14.67 E4-1.1
N$41
  Top 0.152: U3.49 7.49,14.13 7.95,14.59 7.95,15.09 E5+1.1
N$42
  Top 0.076: U2.E8 34.52,11.3 L2.1 36.18,11.45 C19.1
  Top 0.152: L2.1 34.76,11.54
N$43  (via drill 0.13)
  Top 0.076: U2.F3 24.98,10.7 v24.98,10.29
  Top 0.102: U2.F3 25.19,10.88 U2.F3 | v24.84,9.48 C16.2
  Bottom 0.076: v24.84,9.48 24.73,9.59 24.73,10.03 v24.98,10.29
N$44  (via drill 0.13)
  Top 0.076: U2.E4 v25.79,11.1 v25.8,11.1 | v25.88,9.4 25.92,9.36 C16.1
  Bottom 0.076: v25.8,11.1 25.8,10.82 25.74,10.76 25.62,10.76 25.34,10.48 25.34,10.09 25.62,9.82 25.84,9.82 25.88,9.78 v25.88,9.4
N$45  (via drill 0.13)  (1 unrouted)
  Top 0.076: C20.2 v20.25,8.05 v20.24,8.04 | C13.1 22.99,13.36 25.16,13.36 U2.A4 | U2.A4 | v25.4,12.74 U2.A4
  Bottom 0.076: v20.24,8.04 20.24,7.83 20.82,7.83 22.34,9.35 22.34,9.36 22.34,9.65 22.97,10.28 23.4,10.28 24.64,11.52 24.64,11.64 24.84,11.84 24.94,11.84 24.94,12.34 25.34,12.74 v25.4,12.74
N$46
  Top 0.152: U3.48 7.82,13.72 7.82,14.06 8.32,14.56 9.03,14.56 E5-1.1
N$47
  Top 0.152: U3.47 8.12,13.72 8.12,13.97 8.43,14.28 9.53,14.28 10.53,15.28 E6+1.1
N$48  (via drill 0.13)
  Top 0.076: v28.21,12.51 C14.1 | U2.B5 v26.2,12.71 v26.21,12.71
  Bottom 0.076: v26.21,12.71 27.6,12.71 28.02,12.3 28.22,12.5 v28.21,12.51
N$49
  Top 0.152: U3.46 8.43,13.72 8.43,13.88 8.55,14.01 10.53,14.01 E6-1.1
N$50
  Top 0.152: U3.41 10.1,12.86 10.63,12.86 13.29,15.51 E7+1.1
N$51
  Top 0.152: U3.40 10.7,12.53 12.63,14.46 E7-1.1
N$52
  Top 0.152: U3.39 10.79,12.22 11.57,13.01 E8+1.1
N$53
  Top 0.152: U3.38 13.19,11.92 E8-1.1
NC
  Top 0.152: IC1.3
RESET  (via drill 0.13)
  Top 0.076: J2.8 7.92,5.23 7.92,5.24 v7.92,5.97 | U2.B4 25.33,12.25 25.34,12.25 v25.39,12.31
  Bottom 0.076: v7.92,5.97 15.32,5.97 15.32,6.56 21.16,6.56 23.77,9.16 24.04,9.16 24.34,9.46 24.34,10.68 24.95,11.28 25.07,11.28 25.2,11.41 25.2,12.11 v25.39,12.31
SD_CD/DATA3  (via drill 0.13)
  Top 0.076: v23.1,9.7 23.11,9.68 23.42,9.68 23.81,9.29 23.99,9.29 24.57,9.87 24.57,10.68 U2.F2 24.92,10.9 25.11,11.09 25.27,11.09 25.4,10.96 25.4,9.82 26.42,9.82 26.63,10.03 26.63,10.16 26.74,10.27 26.99,10.27 v27.01,10.29 | R4.1 v15.04,7.55
  Bottom 0.076: v23.1,9.7 23.1,9.57 20.98,7.45 15.14,7.45 v15.04,7.55 | v27.01,10.29 27.37,9.92 27.67,9.92 27.8,9.8 27.8,9.59 29.89,7.5 36.7,7.5 37.67,8.46 37.67,10.06 37.68,10.07 J1.2
SDCLK  (via drill 0.13)
  Top 0.076: U2.G4 25.86,10.22 25.87,10.22 | 25.87,10.22 | 25.87,10.22 v25.81,10.29
  Bottom 0.076: J1.5 39.2,6.76 37.77,6.76 37.29,7.24 29.79,7.24 27.54,9.49 27.49,9.49 27.37,9.62 27.37,9.75 27.04,10.07 26.92,10.07 26.85,10.14 26.38,10.14 26.31,10.07 26.13,10.07 25.91,10.29 v25.81,10.29
SDCMD  (via drill 0.13)
  Top 0.076: R5.1 27.22,8.85 U2.H8 27.58,9.72 v27.58,9.71
  Bottom 0.076: v27.58,9.71 27.67,9.62 27.67,9.54 29.84,7.37 36.76,7.37 37.79,8.41 37.79,9 39.19,9 J1.3
SDDATA0  (via drill 0.13)
  Top 0.076: U2.G6 26.68,10.76 | 26.68,10.76 | 26.68,10.76 26.68,10.75 v26.62,10.69
  Top 0.152: v38.07,5.12 34.4,5.12 34.36,5.08 R1.1
  Bottom 0.076: v26.62,10.69 26.43,10.5 25.72,10.5 25.59,10.37 25.59,10.2 25.72,10.07 25.9,10.07 25.92,10.09 25.93,10.09 26.07,9.94 26.37,9.94 26.39,9.96 26.85,9.96 26.87,9.94 26.99,9.94 27.24,9.69 27.24,9.56 27.44,9.36 27.49,9.36 29.74,7.12 37.23,7.12 37.77,6.58 37.77,4.58 37.77,4.57 38.07,4.57 | 38.07,4.57 J1.7 | v38.07,5.12 38.07,4.57
SDDATA1  (via drill 0.13)
  Top 0.076: v22.68,9.5 22.71,9.48 22.73,9.48 23.19,9.48 23.25,9.54 23.38,9.54 23.76,9.16 24.04,9.16 24.65,9.77 24.94,9.77 25.02,9.69 26.47,9.69 26.75,9.98 26.75,10.02 U2.H7 26.82,9.76 v26.95,9.63 | R2.1 v15.99,7.74 | v15.99,7.74
  Bottom 0.076: v22.68,9.5 22.68,9.33 20.92,7.57 16.08,7.57 15.99,7.66 v15.99,7.74 | v26.95,9.63 26.99,9.63 27.39,9.24 27.43,9.24 29.68,6.99 37.18,6.99 37.64,6.53 37.64,3.53 37.7,3.47 J1.8
SDDATA2  (via drill 0.13)
  Top 0.076: v26.21,7.88 27.21,7.88 R3.1 | U2.G5 26.27,10.22 26.28,10.22 | 26.28,10.22 | 26.28,10.22 v26.22,10.29
  Bottom 0.076: v26.21,7.88 26.21,9.63 25.9,9.94 25.67,9.94 25.47,10.14 25.47,10.43 25.67,10.63 26.26,10.63 26.53,10.91 26.71,10.91 26.84,10.78 26.84,10.54 26.88,10.5 | v26.22,10.29 26.67,10.29 26.88,10.5 | 26.88,10.5 27.1,10.5 27.33,10.27 27.33,10.14 27.42,10.05 27.73,10.05 27.93,9.85 27.93,9.64 29.95,7.62 36.65,7.62 37.54,8.51 37.54,11.18 J1.1
SPI_MISO  (via drill 0.13)
  Top 0.076: U2.E2 24.65,11.3 24.46,11.49 24.3,11.49 24.19,11.38 24.19,11.15 23.53,10.5 23.53,9.94 v23.44,9.94
  Top 0.152: U3.25 8.4,8.23 8.1,7.93 v8.1,7.73
  Bottom 0.076: v23.44,9.94 23.44,9.73 21.03,7.32 8.51,7.32 v8.1,7.73
SPI_MOSI  (via drill 0.13)
  Top 0.076: U2.G1 24.03,10.14 | 24.03,10.14 | 24.03,10.14 v24,10.11
  Top 0.152: U3.23 v7.79,7.76 v7.8,7.75
  Bottom 0.076: v7.8,7.75 7.77,7.73 7.77,7.19 21.08,7.19 v24,10.11
SPI_SCLK  (via drill 0.13)
  Top 0.076: U2.F1 23.79,10.3 23.79,10.02 23.91,9.9 v24,9.81 | v24,9.81 | v7.16,7.7 7.16,8.2 7.19,8.22
  Top 0.152: U3.21 7.18,8.23 7.19,8.22
  Bottom 0.076: v24,9.81 23.95,9.76 23.83,9.76 21.13,7.07 7.16,7.07 v7.16,7.7
SWDCLK  (via drill 0.13)
  Top 0.076: U2.C5 25.73,11.84 | 25.73,11.84 | 25.73,11.84 v25.79,11.9 v25.79,11.91 | v15.54,6.02 J2.5
  Bottom 0.076: v25.79,11.91 25.32,11.45 25.32,11.36 25.12,11.16 25,11.16 24.47,10.63 24.47,9.41 24.09,9.03 23.82,9.03 21.22,6.43 15.54,6.43 v15.54,6.02
SWDIO  (via drill 0.13)
  Top 0.076: v18.11,6 18.11,4.72 J2.4 | v25.79,11.5 25.99,11.71 U2.D5
  Bottom 0.076: v18.11,6 18.11,6.3 21.27,6.3 23.87,8.91 24.15,8.91 24.6,9.36 24.6,10.58 25.05,11.03 25.22,11.03 25.71,11.51 v25.78,11.51 v25.79,11.5
(copper drawn outside any net)
  shapes: Top area x2